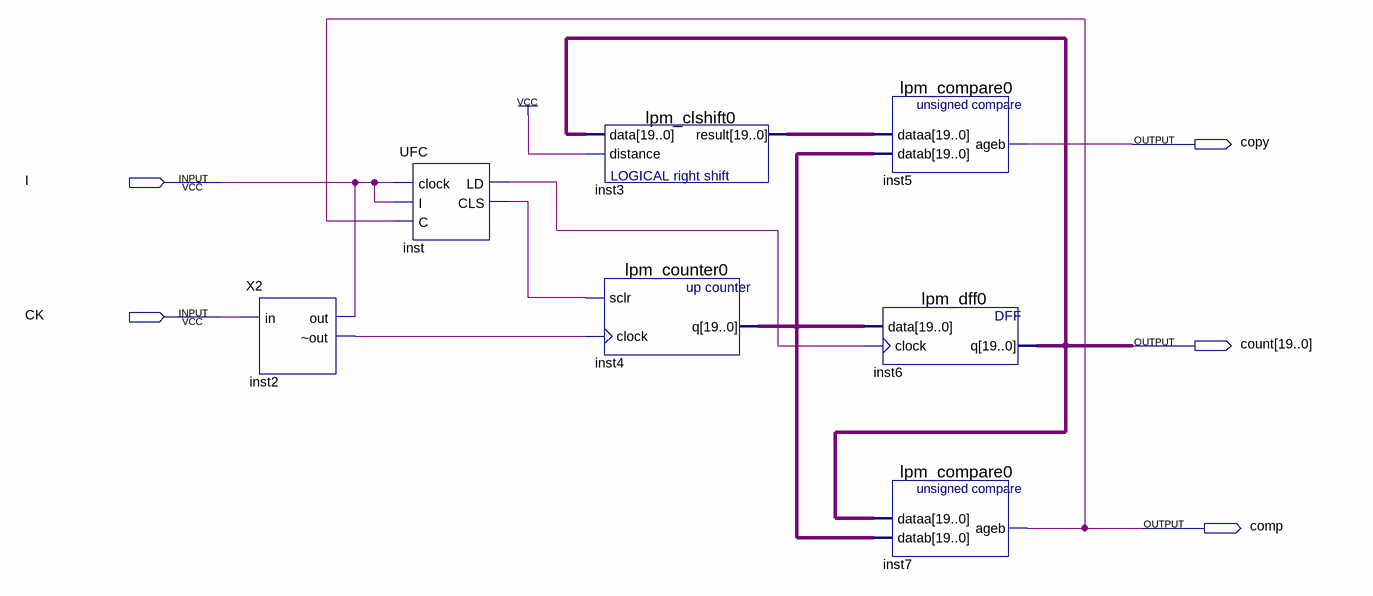
[diagram p0: schematic sheet]
// Quartus schematic RST_Project.bdf as structural Verilog: 7 symbols, 5 pins
module RST_Project (
  input  I,
  input  CK,
  output copy,
  output [19:0] count,
  output comp
);

  wire inst2__out, inst_cls, inst_ld;
  wire [19:0] inst3_result, inst4_q;

  X2 inst2 (.in(CK), .out(I), .\~out (inst2__out));
  UFC inst (.clock(I), .I(I), .C(comp), .LD(inst_ld), .CLS(inst_cls));
  lpm_clshift0 inst3 (.data(count), .distance(1'b1), .result(inst3_result));
  lpm_counter0 inst4 (.sclr(inst_cls), .clock(inst2__out), .q(inst4_q));
  lpm_compare0 inst5 (.dataa(inst3_result), .datab(inst4_q), .ageb(copy));
  lpm_dff0 inst6 (.data(inst4_q), .clock(inst_ld), .q(count));
  lpm_compare0 inst7 (.dataa(count), .datab(inst4_q), .ageb(comp));
endmodule
